# Altium schematic sheet [04]-CPU-JTAG,POWER.SchDoc: S32K1_CONTROLLER
size A3; SheetNumber: 04; SheetTotal: 11
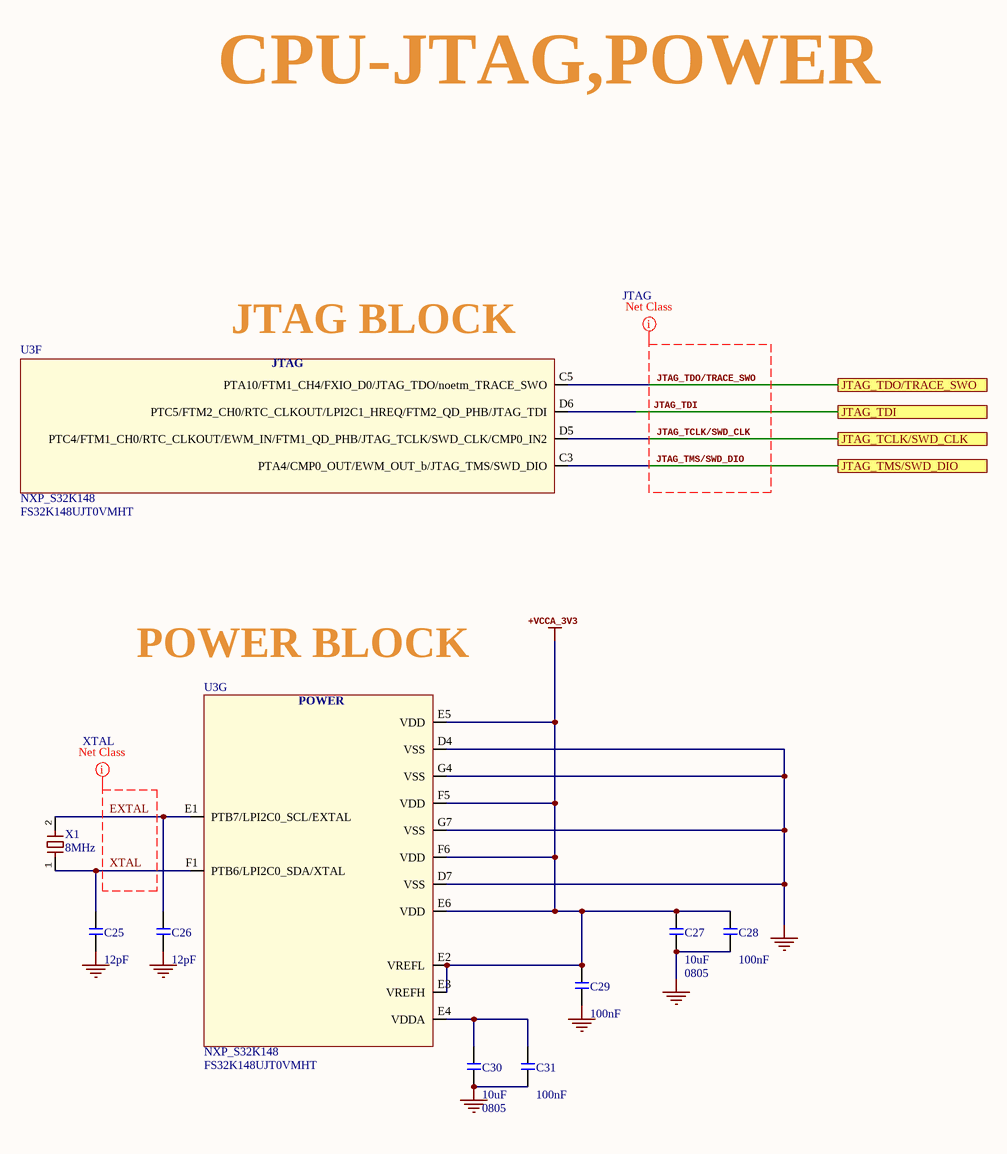
[diagram p0: [04]-CPU-JTAG,POWER.SchDoc]

## Parts
C25  value 12pF  [CAP0402]  (hidden comment: GCQ1555C1H120GB01D)
C26  value 12pF  [CAP0402]  (hidden comment: GCQ1555C1H120GB01D)
C27  Capacitance: 10uF  Case/Package: 0805  [CAP0805]  (hidden comment: CGA4J1X5R1C106K125AC)
C28  Capacitance: 100nF  [CAP0402]  (hidden comment: GCM155R71C104KA55D)
C29  Capacitance: 100nF  [CAP0402]  (hidden comment: GCM155R71C104KA55D)
C30  Capacitance: 10uF  Case/Package: 0805  [CAP0805]  (hidden comment: CGA4J1X5R1C106K125AC)
C31  Capacitance: 100nF  [CAP0402]  (hidden comment: GCM155R71C104KA55D)
U3  NXP_S32K148  Manufacturer Part Number: FS32K148UJT0VMHT  [WEONREFERENCEPLATFORM_100MAPBGA]  (parts F,G of 8)
X1  value 8MHz  [CRYSTAL_NX3225]  (hidden comment: NX3225GD-8MHZ-EXS00A-CG04874)

## Ports
JTAG_TCLK/SWD_CLK, JTAG_TDI, JTAG_TDO/TRACE_SWO, JTAG_TMS/SWD_DIO

## Nets
+VCCA_3V3: C27.1 C28.1 C29.1 U3.E2(VREFL) U3.E3(VREFH) U3.E5(VDD) U3.E6(VDD) U3.F5(VDD) U3.F6(VDD)
GND: C25.2 C26.2 C27.2 C28.2 C29.2 C30.2 C31.2 U3.D4(VSS) U3.D7(VSS) U3.G4(VSS) U3.G7(VSS)
EXTAL: C26.1 U3.E1(PTB7/LPI2C0_SCL/EXTAL) X1.2
JTAG_TCLK/SWD_CLK: U3.D5(PTC4/FTM1_CH0/RTC_CLKOUT/EWM_IN/FTM1_QD_PHB/JTAG_TCLK/SWD_CLK/CMP0_IN2) ; port JTAG_TCLK/SWD_CLK
JTAG_TDI: U3.D6(PTC5/FTM2_CH0/RTC_CLKOUT/LPI2C1_HREQ/FTM2_QD_PHB/JTAG_TDI) ; port JTAG_TDI
JTAG_TDO/TRACE_SWO: U3.C5(PTA10/FTM1_CH4/FXIO_D0/JTAG_TDO/noetm_TRACE_SWO) ; port JTAG_TDO/TRACE_SWO
JTAG_TMS/SWD_DIO: U3.C3(PTA4/CMP0_OUT/EWM_OUT_b/JTAG_TMS/SWD_DIO) ; port JTAG_TMS/SWD_DIO
XTAL: C25.1 U3.F1(PTB6/LPI2C0_SDA/XTAL) X1.1
NetC30_1: C30.1 C31.1 U3.E4(VDDA)

## Layout directives
net class JTAG: JTAG_TCLK/SWD_CLK, JTAG_TDI, JTAG_TDO/TRACE_SWO, JTAG_TMS/SWD_DIO
net class XTAL: EXTAL, XTAL

## Notes on the sheet
- CPU-JTAG,POWER
- JTAG BLOCK
- POWER BLOCK
- Labels drawn without touching a wire or pin: +VCCA_3V3
- Title
- Size:
- Date:
- A3
- Number:
- Time:
- Revision:
- Sheet
- of
- File:
- (in symbol NXP_S32K148, part F) JTAG
- (in symbol NXP_S32K148, part G) POWER

## Library data of the parts
C25 C26 = GCQ1555C1H120GB01D: Cap Ceramic 12pF 50V C0G 2% Pad SMD 0402 125C Automotive T/R; Manufacturer: Murata; Supplier 1: Mouser; Manufacturer Part Number: GCQ1555C1H120GB01D; Stock 1: 18590; Pricing 1: 1 = 0.41000, 10 = 0.28100, 50 = 0.28100, 100 = 0.16900, 1000 = 0.10700, 10000 = 0.07600 (USD); Supplier Part Number 1: 81-GCQ1555C1H120GB1D
C27 C30 = CGA4J1X5R1C106K125AC: CGA Series 0805 10 uF 16 V ±10 % Tolerance X5R SMT Multilayer Ceramic Capacitor; Manufacturer: TDK; Tolerance: 10%; Voltage Rating: 16V; Supplier 1: Digi-Key; Manufacturer Part Number: CGA4J1X5R1C106K125AC; Stock 1: 128127; Pricing 1: 1 = 0.60000, 10 = 0.41400, 100 = 0.24840, 500 = 0.18630, 1000 = 0.15732 (USD); Mount: Surface Mount; Weight: 0.000194oz; Case Code (Metric): 2012; Case Code (Imperial): 0805; Min Operating Temperature: -55°C; Max Operating Temperature: 85°C; Package Quantity: 1; Packaging: Tape and Reel; Voltage Rating (DC): 16V; Dielectric: X5R; Termination: SMD/SMT; Composition: Ceramic; Length: 2mm; Height: 1.25mm; Width: 0.049inch; Thickness: 0.049inch; Depth: 1.25mm; Ratings: AEC-Q200; REACH SVHC: No SVHC; Lead Free: Lead Free; ComponentLink1URL: http://product.tdk.com/capacitor/mlcc/detailed_information.php?lang=en&amp;ref=jp&amp;part_no=CGA4J1X5R1C106K125AC&src-supplier=Mouser; ComponentLink1Description: http://product.tdk.com/capacitor/mlcc/detailed_information.php?lang=en&amp;ref=jp&amp;part_no=CGA4J1X5R1C106K125AC&src-supplier=Mouser; ComponentLink2URL: http://www.farnell.com/datasheets/1807242.pdf?src-supplier=Element14; ComponentLink2Description: http://www.farnell.com/datasheets/1807242.pdf?src-supplier=Element14; ComponentLink3URL: http://datasheet.octopart.com/CGA4J1X5R1C106K125AC-TDK-datasheet-12956201.pdf?src-supplier=Newark; ComponentLink3Description: http://datasheet.octopart.com/CGA4J1X5R1C106K125AC-TDK-datasheet-12956201.pdf?src-supplier=Newark; ComponentLink4URL: http://datasheet.octopart.com/CGA4J1X5R1C106K125AC-TDK-datasheet-13376850.pdf?src-supplier=Newark; ComponentLink4Description: http://datasheet.octopart.com/CGA4J1X5R1C106K125AC-TDK-datasheet-13376850.pdf?src-supplier=Newark; ComponentLink5URL: http://datasheet.octopart.com/CGA4J1X5R1C106K125AC-TDK-datasheet-33009218.pdf?src-supplier=Newark; ComponentLink5Description: http://datasheet.octopart.com/CGA4J1X5R1C106K125AC-TDK-datasheet-33009218.pdf?src-supplier=Newark; ComponentLink6URL: http://datasheet.octopart.com/CGA4J1X5R1C106K125AC-TDK-datasheet-32363556.pdf?src-supplier=Future+Electronics; ComponentLink6Description: http://datasheet.octopart.com/CGA4J1X5R1C106K125AC-TDK-datasheet-32363556.pdf?src-supplier=Future+Electronics; ComponentLink7URL: http://datasheet.octopart.com/CGA4J1X5R1C106K125AC-TDK-datasheet-26765558.pdf?src-supplier=Future+Electronics; ComponentLink7Description: http://datasheet.octopart.com/CGA4J1X5R1C106K125AC-TDK-datasheet-26765558.pdf?src-supplier=Future+Electronics; ComponentLink8URL: http://datasheet.octopart.com/CGA4J1X5R1C106K125AC-TDK-datasheet-43366117.pdf?src-supplier=Newark; ComponentLink8Description: http://datasheet.octopart.com/CGA4J1X5R1C106K125AC-TDK-datasheet-43366117.pdf?src-supplier=Newark; Supplier Part Number 1: 445-7883-1-ND
C28 C29 C31 = GCM155R71C104KA55D: Multilayer Ceramic Capacitors (MLCC) - SMD/SMT 0402 0.1uF 16volts X7R 10%; Manufacturer: Murata; Voltage Rating: 16V; Supplier 1: Arrow; Manufacturer Part Number: GCM155R71C104KA55D; Stock 1: 10660000; Pricing 1: 10000 = 0.01910, 1 = 0.05560, 10 = 0.04750, 25 = 0.03370, 100 = 0.02190, 250 = 0.02080 (USD); Mount: Surface Mount; Case/Package: 0402; Case Code (Metric): 1005; Case Code (Imperial): 0402; Min Operating Temperature: -55°C; Max Operating Temperature: 125°C; Package Quantity: 1; Tolerance: 10%; Packaging: Tape and Reel; Dielectric: X7R; Voltage Rating (DC): 16V; Termination: SMD/SMT; Voltage: 16V; Length: 1mm; Height: 0.5mm; Width: 0.02inch; Thickness: 0.022inch; Depth: 0.5mm; Ratings: AEC-Q200; Radiation Hardening: No; REACH SVHC: No SVHC; Lead Free: Lead Free; ComponentLink1URL: http://psearch.en.murata.com/capacitor/product/GCM155R71C104KA55%23.pdf?src-supplier=Avnet; ComponentLink1Description: http://psearch.en.murata.com/capacitor/product/GCM155R71C104KA55%23.pdf?src-supplier=Avnet; ComponentLink2URL: http://search.murata.co.jp/Ceramy/image/img/A01X/partnumbering_e_02.pdf?src-supplier=Digi-Key; ComponentLink2Description: http://search.murata.co.jp/Ceramy/image/img/A01X/partnumbering_e_02.pdf?src-supplier=Digi-Key; ComponentLink3URL: http://uk.rs-online.com/webdocs/1423/0900766b81423e06.pdf?src-supplier=RSComponents; ComponentLink3Description: http://uk.rs-online.com/webdocs/1423/0900766b81423e06.pdf?src-supplier=RSComponents; ComponentLink4URL: https://www.verical.com/server-webapp/html/getDatasheet?partID=220774&src-supplier=Verical; ComponentLink4Description: https://www.verical.com/server-webapp/html/getDatasheet?partID=220774&src-supplier=Verical; ComponentLink5URL: http://datasheet.octopart.com/GCM155R71C104KA55D-Murata-datasheet-11777063.pdf?src-supplier=_legacy+Avnet; ComponentLink5Description: http://datasheet.octopart.com/GCM155R71C104KA55D-Murata-datasheet-11777063.pdf?src-supplier=_legacy+Avnet; ComponentLink6URL: http://datasheet.octopart.com/GCM155R71C104KA55D-Murata-datasheet-14404342.pdf?src-supplier=Future+Electronics; ComponentLink6Description: http://datasheet.octopart.com/GCM155R71C104KA55D-Murata-datasheet-14404342.pdf?src-supplier=Future+Electronics; ComponentLink7URL: http://datasheet.octopart.com/GCM155R71C104KA55D-Murata-datasheet-12515163.pdf?src-supplier=Farnell; ComponentLink7Description: http://datasheet.octopart.com/GCM155R71C104KA55D-Murata-datasheet-12515163.pdf?src-supplier=Farnell; ComponentLink8URL: http://datasheet.octopart.com/GCM155R71C104KA55D-Murata-datasheet-44104237.pdf?src-supplier=Future+Electronics; ComponentLink8Description: http://datasheet.octopart.com/GCM155R71C104KA55D-Murata-datasheet-44104237.pdf?src-supplier=Future+Electronics; ComponentLink9URL: http://datasheet.octopart.com/GCM155R71C104KA55D-Murata-datasheet-62117434.pdf?src-supplier=TME; ComponentLink9Description: http://datasheet.octopart.com/GCM155R71C104KA55D-Murata-datasheet-62117434.pdf?src-supplier=TME; Supplier Part Number 1: GCM155R71C104KA55D
U3 = NXP_S32K148: Manufacturer: NXP Semiconductors; Supplier 1: Digikey; Stock 1: 855; Pricing 1: 1 = 16.32000, 10 = 14.99600, 25 = 14.37440, 100 = 12.66510, 880 = 11.26650 (USD); Supplier Part Number 1: 568-13929-ND
X1 = NX3225GD-8MHZ-EXS00A-CG04874: Crystal 8MHZ 8PF SMD; Manufacturer: NDK; Supplier 1: Digi-Key; Manufacturer Part Number: NX3225GD-8MHZ-EXS00A-CG04874; Stock 1: 5784; Pricing 1: 1 = 0.77000, 10 = 0.68300, 50 = 0.63860, 100 = 0.56430, 500 = 0.53460, 1000 = 0.44550 (USD); Supplier Part Number 1: 644-1391-1-ND